# Altium schematic sheet ArduinoMega.SchDoc
size A
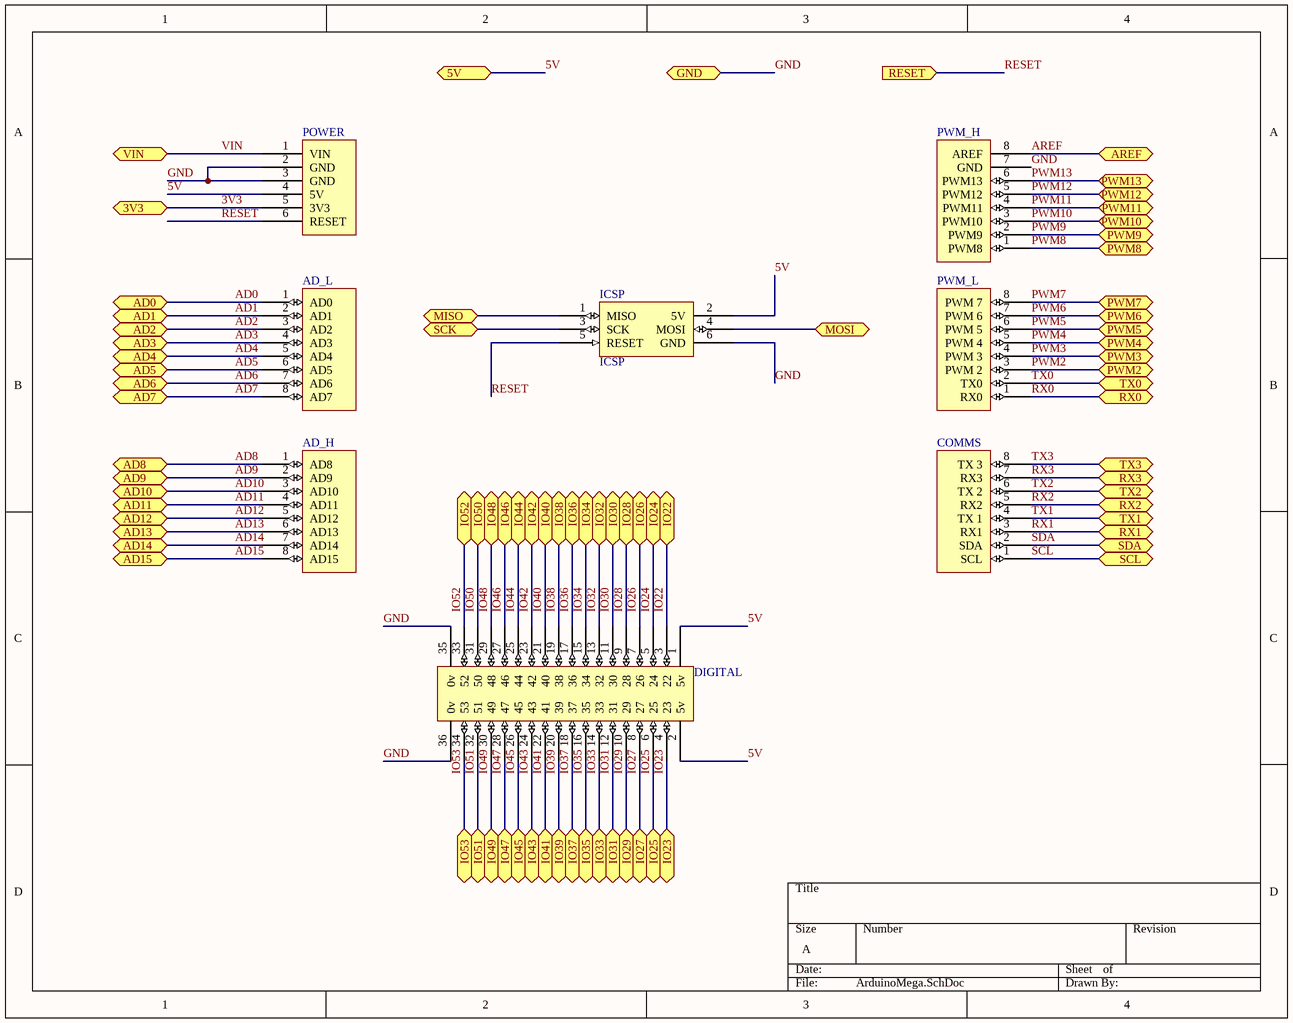
[diagram p0: ArduinoMega.SchDoc]

## Parts
AD_H  AD_H  [HDR1X8]  (value not drawn)
AD_L  AD_L  [HDR1X8]  (value not drawn)
COMMS  Communication  [HDR1X8]  (value not drawn)
DIGITAL  IO_36  [HDR2X18]  (value not drawn)
ICSP  ICSP  [ICSP]
POWER  POWER  [HDR1X6]  (value not drawn)
PWM_H  PWM_H  [HDR1X8]  (value not drawn)
PWM_L  PWM_L  [HDR1X8]  (value not drawn)

## Ports
3V3, 5V, AD0 (bidir), AD1 (bidir), AD2 (bidir), AD3 (bidir), AD4 (bidir), AD5 (bidir), AD6 (bidir), AD7 (bidir), AD8 (bidir), AD9 (bidir), AD10 (bidir), AD11 (bidir), AD12 (bidir), AD13 (bidir), AD14 (bidir), AD15 (bidir), AREF (bidir), GND, IO22 (bidir), IO23 (bidir), IO24 (bidir), IO25 (bidir), IO26 (bidir), IO27 (bidir), IO28 (bidir), IO29 (bidir), IO30 (bidir), IO31 (bidir), IO32 (bidir), IO33 (bidir), IO34 (bidir), IO35 (bidir), IO36 (bidir), IO37 (bidir), IO38 (bidir), IO39 (bidir), IO40 (bidir), IO41 (bidir), IO42 (bidir), IO43 (bidir), IO44 (bidir), IO45 (bidir), IO46 (bidir), IO47 (bidir), IO48 (bidir), IO49 (bidir), IO50 (bidir), IO51 (bidir), IO52 (bidir), IO53 (bidir), MISO (bidir), MOSI (bidir), PWM2 (bidir), PWM3 (bidir), PWM4 (bidir), PWM5 (bidir), PWM6 (bidir), PWM7 (bidir), PWM8 (bidir), PWM9 (bidir), PWM10 (bidir), PWM11 (bidir), PWM12 (bidir), PWM13 (bidir), RESET (in), RX0 (bidir), RX1 (bidir), RX2 (bidir), RX3 (bidir), SCK (bidir), SCL (bidir), SDA (bidir), TX0 (bidir), TX1 (bidir), TX2 (bidir), TX3 (bidir), VIN

## Nets
3V3: POWER.5(3V3) ; port 3V3
5V: DIGITAL.1(5v) DIGITAL.2(5v) ICSP.2(5V) POWER.4(5V) ; port 5V
AD0: AD_L.1(AD0) ; port AD0
AD1: AD_L.2(AD1) ; port AD1
AD2: AD_L.3(AD2) ; port AD2
AD3: AD_L.4(AD3) ; port AD3
AD4: AD_L.5(AD4) ; port AD4
AD5: AD_L.6(AD5) ; port AD5
AD6: AD_L.7(AD6) ; port AD6
AD7: AD_L.8(AD7) ; port AD7
AD8: AD_H.1(AD8) ; port AD8
AD9: AD_H.2(AD9) ; port AD9
AD10: AD_H.3(AD10) ; port AD10
AD11: AD_H.4(AD11) ; port AD11
AD12: AD_H.5(AD12) ; port AD12
AD13: AD_H.6(AD13) ; port AD13
AD14: AD_H.7(AD14) ; port AD14
AD15: AD_H.8(AD15) ; port AD15
AREF: PWM_H.8(AREF) ; port AREF
GND: DIGITAL.35(0v) DIGITAL.36(0v) ICSP.6(GND) POWER.2(GND) POWER.3(GND) PWM_H.7(GND) ; port GND
IO22: DIGITAL.3(22) ; port IO22
IO23: DIGITAL.4(23) ; port IO23
IO24: DIGITAL.5(24) ; port IO24
IO25: DIGITAL.6(25) ; port IO25
IO26: DIGITAL.7(26) ; port IO26
IO27: DIGITAL.8(27) ; port IO27
IO28: DIGITAL.9(28) ; port IO28
IO29: DIGITAL.10(29) ; port IO29
IO30: DIGITAL.11(30) ; port IO30
IO31: DIGITAL.12(31) ; port IO31
IO32: DIGITAL.13(32) ; port IO32
IO33: DIGITAL.14(33) ; port IO33
IO34: DIGITAL.15(34) ; port IO34
IO35: DIGITAL.16(35) ; port IO35
IO36: DIGITAL.17(36) ; port IO36
IO37: DIGITAL.18(37) ; port IO37
IO38: DIGITAL.19(38) ; port IO38
IO39: DIGITAL.20(39) ; port IO39
IO40: DIGITAL.21(40) ; port IO40
IO41: DIGITAL.22(41) ; port IO41
IO42: DIGITAL.23(42) ; port IO42
IO43: DIGITAL.24(43) ; port IO43
IO44: DIGITAL.25(44) ; port IO44
IO45: DIGITAL.26(45) ; port IO45
IO46: DIGITAL.27(46) ; port IO46
IO47: DIGITAL.28(47) ; port IO47
IO48: DIGITAL.29(48) ; port IO48
IO49: DIGITAL.30(49) ; port IO49
IO50: DIGITAL.31(50) ; port IO50
IO51: DIGITAL.32(51) ; port IO51
IO52: DIGITAL.33(52) ; port IO52
IO53: DIGITAL.34(53) ; port IO53
MISO: ICSP.1(MISO) ; port MISO
MOSI: ICSP.4(MOSI) ; port MOSI
PWM2: PWM_L.3(PWM_2) ; port PWM2
PWM3: PWM_L.4(PWM_3) ; port PWM3
PWM4: PWM_L.5(PWM_4) ; port PWM4
PWM5: PWM_L.6(PWM_5) ; port PWM5
PWM6: PWM_L.7(PWM_6) ; port PWM6
PWM7: PWM_L.8(PWM_7) ; port PWM7
PWM8: PWM_H.1(PWM8) ; port PWM8
PWM9: PWM_H.2(PWM9) ; port PWM9
PWM10: PWM_H.3(PWM10) ; port PWM10
PWM11: PWM_H.4(PWM11) ; port PWM11
PWM12: PWM_H.5(PWM12) ; port PWM12
PWM13: PWM_H.6(PWM13) ; port PWM13
RESET: ICSP.5(RESET) POWER.6(RESET) ; port RESET
RX0: PWM_L.1(RX0) ; port RX0
RX1: COMMS.3(RX1) ; port RX1
RX2: COMMS.5(RX2) ; port RX2
RX3: COMMS.7(RX3) ; port RX3
SCK: ICSP.3(SCK) ; port SCK
SCL: COMMS.1(SCL) ; port SCL
SDA: COMMS.2(SDA) ; port SDA
TX0: PWM_L.2(TX0) ; port TX0
TX1: COMMS.4(TX_1) ; port TX1
TX2: COMMS.6(TX_2) ; port TX2
TX3: COMMS.8(TX_3) ; port TX3
VIN: POWER.1(VIN) ; port VIN